# Altium project ENGR451_Project.PrjPcb
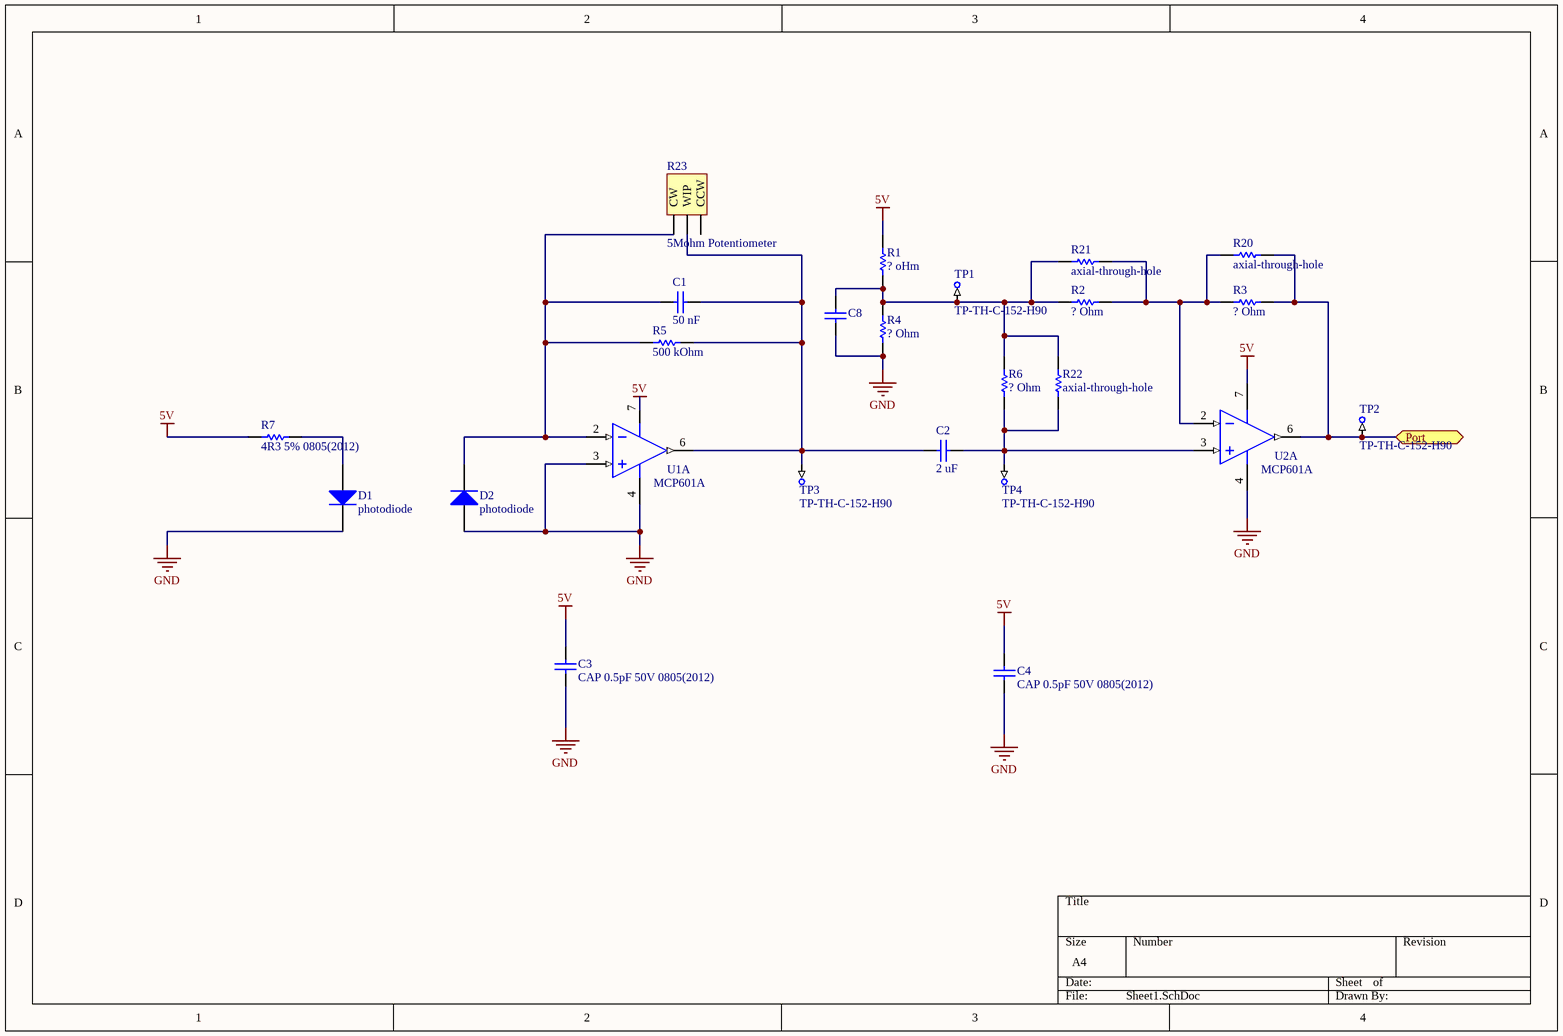
[diagram p0: Sheet1.SchDoc]
2 sheets, 51 parts. Net scope: flat (ports and power ports of the same name join across sheets).
Board file: PCB1.PcbDoc
Sheets:
  Sheet1.SchDoc
  Sheet2.SchDoc

## Sheet Sheet1.SchDoc
size A4

### Parts
C1  50 nF  [CAPC0805(2012)75_M]
C2  2 uF  [CAPC0805(2012)75_M]
C3  CAP 0.5pF 50V 0805(2012)  [CAPC0805(2012)75_M]
C4  CAP 0.5pF 50V 0805(2012)  [CAPC0805(2012)75_M]
C8  CAP 0.5pF 50V 0805(2012)  [CAPC0805(2012)75_M]  (value not drawn)
D1  photodiode  [3mm_diode]
D2  photodiode  [3mm_diode]
R1  ? oHm  [RESC0805(2012)_M]
R2  ? Ohm  [RESC0805(2012)_M]
R3  ? Ohm  [RESC0805(2012)_M]
R4  ? Ohm  [RESC0805(2012)_M]
R5  500 kOhm  [RESC0805(2012)_M]
R6  ? Ohm  [RESC0805(2012)_M]
R7  4R3 5% 0805(2012)  [RESC0805(2012)_M]
R20  axial-through-hole  [Axial_resistor]
R21  axial-through-hole  [Axial_resistor]
R22  axial-through-hole  [Axial_resistor]
R23  5Mohm Potentiometer  [5k_pot]
TP1  TP-TH-C-152-H90  [TP-TH-C-152-H90]  (no BOM)
TP2  TP-TH-C-152-H90  [TP-TH-C-152-H90]  (no BOM)
TP3  TP-TH-C-152-H90  [TP-TH-C-152-H90]  (no BOM)
TP4  TP-TH-C-152-H90  [TP-TH-C-152-H90]  (no BOM)
U1  MCP601A  [ADI-Q-8]  (part A of 2)
U2  MCP601A  [ADI-Q-8]  (part A of 2)

### Ports
Port

### Nets
5V: C3.2 C4.2 R1.2 R7.2 U1.7(+V) U2.7(+V)
GND: C3.1 C4.1 C8.1 D1.2(K) D2.1(A) R4.1 U1.3(+IN) U1.4(-V) U2.4(-V)
NetC1_1: C1.1 C2.2 R5.2 R23.2(WIP) TP3.1 U1.6(OUT)
NetC1_2: C1.2 D2.2(K) R5.1 R23.1(CW) U1.2(-IN)
NetC2_1: C2.1 R6.1 R22.1 TP4.1 U2.3(+IN)
NetC8_2: C8.2 R1.1 R2.1 R4.2 R6.2 R21.1 R22.2 TP1.1
NetD1_1: D1.1(A) R7.1
NetR2_2: R2.2 R3.1 R20.1 R21.2 U2.2(-IN)
NetR3_2: R3.2 R20.2 TP2.1 U2.6(OUT) ; port Port

Not connected (* = marked no-connect by the designer): R23 3(CCW)

### Library data of the parts
C1-C4 C8 = CMP-1036-00018-1: CAP 0.5pF 50V ±0.1pF 0805 (2012 Metric) Thickness 0.75mm SMD; Case-EIA: 0805; Case-Metric: 2012; Tolerance: Â±0.1pF; Value: 0.5pF; Technology: SMT; Rated Voltage: 50 V; Max Thickness: 0.75 mm
R1-R7 = CMP-1013-00017-1: 4R3 0.125W 5% 0805 (2012 Metric)  SMD; Value: 4.30 Ohm; Case-Metric: 2012; Case-EIA: 0805; Tolerance: 5 %; Power: 0.125 W; Technology: SMT
R20-R22 = axial-through-hole: through-hole
R23 = 5Mohm Potentiometer: 3296W-1-505LF; Manufacturer PN: 3296W-1-505LF
TP1-TP4 = CMP-0484-00003-2: Test Point, Through Hole, Hole Size 0.9 mm, PCB Mount with Silkscreen Box; Manufacturer: No Vendor; PartNumber: TP-TH-C-152-H90
U1 U2 = CMP-0384-00317-1: Single Channel Low Power Operational Amplifier, 880 MHz BW, 1 KV/us SR, Military, 8-pin DIP (Q-8), Tube; Manufacturer: Analog Devices; PartNumber: 5962-9459301MPA; Generic Part Number: AD8001; Input Offset Voltage: 2mV; Small Signal Bandwidth: 880MHz; Slew Rate: 1KV/us; Input Bias Current: 3uA; Iq/Amp: 5mA; Amplifiers Per Package: 1; V Span Max: 12V; V Span Min: 6V; DatasheetVersion: Rev. D; PackageReference: Q-8; PackageDescription: 8-Pin Ceramic Dual In-Line Package, Row spacing 7.62 mm, Pitch 2.54 mm; Mounting Technology: Through Hole; ComponentLink1URL: http://www.analog.com/en/index.html; ComponentLink2Description: Datasheet; ComponentLink3URL: http://www.analog.com/static/imported-files/packages/3925655241313314758Q_8.pdf; ComponentLink1Description: Manufacturer URL; ComponentLink2URL: http://www.analog.com/static/imported-files/data_sheets/AD8001.pdf; ComponentLink3Description: Package Specification; PartId: 1
D1 D2 = photodiode: partnumber: *

## Sheet Sheet2.SchDoc
size A4
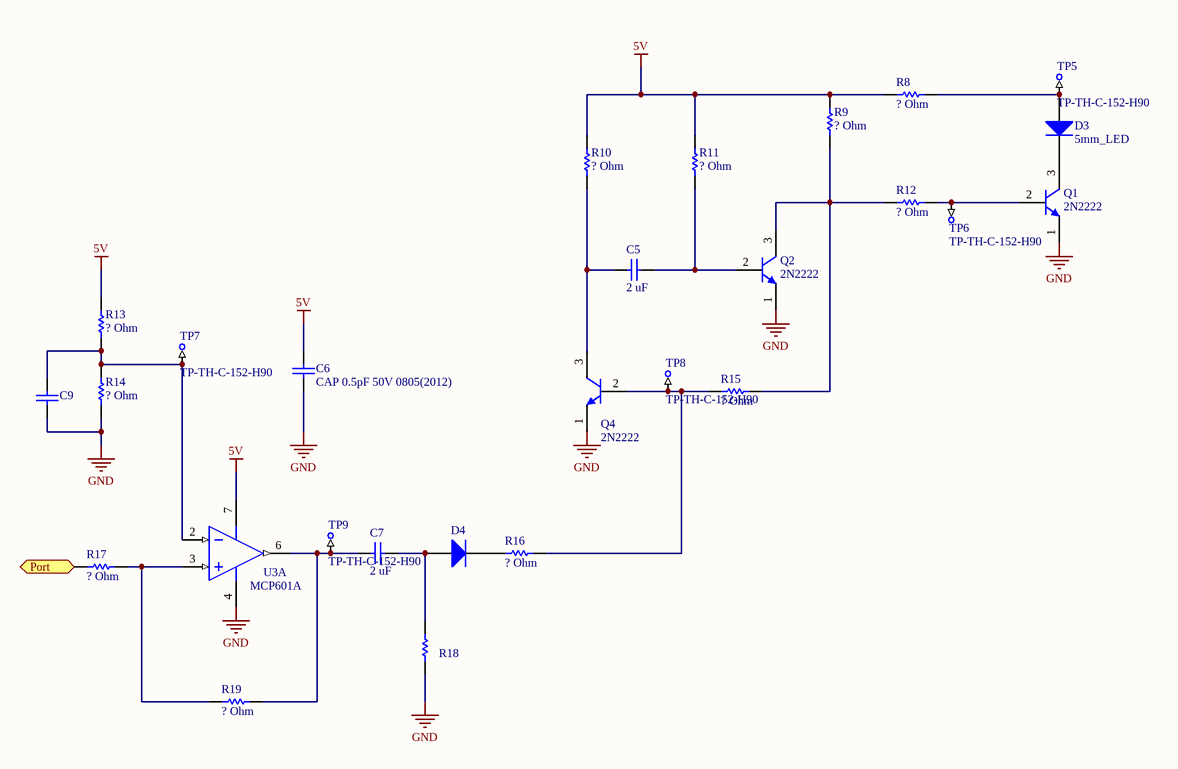
[diagram p1: Sheet2.SchDoc]

### Parts
C5  2 uF  [CAPC0805(2012)75_M]
C6  CAP 0.5pF 50V 0805(2012)  [CAPC0805(2012)75_M]
C7  2 uF  [CAPC0805(2012)75_M]
C9  CAP 0.5pF 50V 0805(2012)  [CAPC0805(2012)75_M]  (value not drawn)
D3  5mm_LED  [3mm_diode]
D4  (no value)  [DIOD-S1M-13-F-SMA-2_V]
Q1  2N2222  [MLTC-TO-18-3]
Q2  2N2222  [MLTC-TO-18-3]
Q4  2N2222  [MLTC-TO-18-3]
R8  ? Ohm  [RESC0805(2012)_M]
R9  ? Ohm  [RESC0805(2012)_M]
R10  ? Ohm  [RESC0805(2012)_M]
R11  ? Ohm  [RESC0805(2012)_M]
R12  ? Ohm  [RESC0805(2012)_M]
R13  ? Ohm  [RESC0805(2012)_M]
R14  ? Ohm  [RESC0805(2012)_M]
R15  ? Ohm  [RESC0805(2012)_M]
R16  ? Ohm  [RESC0805(2012)_M]
R17  ? Ohm  [RESC0805(2012)_M]
R18  (no value)  [RESC0805(2012)_M]
R19  ? Ohm  [RESC0805(2012)_M]
TP5  TP-TH-C-152-H90  [TP-TH-C-152-H90]  (no BOM)
TP6  TP-TH-C-152-H90  [TP-TH-C-152-H90]  (no BOM)
TP7  TP-TH-C-152-H90  [TP-TH-C-152-H90]  (no BOM)
TP8  TP-TH-C-152-H90  [TP-TH-C-152-H90]  (no BOM)
TP9  TP-TH-C-152-H90  [TP-TH-C-152-H90]  (no BOM)
U3  MCP601A  [ADI-Q-8]  (part A of 2)

### Ports
Port

### Nets
5V: C6.2 R8.1 R9.1 R10.1 R11.1 R13.2 U3.7(+V)
GND: C6.1 C9.1 Q1.1(E) Q2.1(E) Q4.1(E) R14.2 R18.2 U3.4(-V)
NetC5_1: C5.1 Q2.2(B) R11.2
NetC5_2: C5.2 Q4.3(C) R10.2
NetC7_1: C7.1 R19.1 TP9.1 U3.6(OUT)
NetC7_2: C7.2 D4.1(A) R18.1
NetC9_2: C9.2 R13.1 R14.1 TP7.1 U3.2(-IN)
NetD3_1: D3.1(A) R8.2 TP5.1
NetD3_2: D3.2(K) Q1.3(C)
NetD4_2: D4.2(K) R16.1
NetQ1_2: Q1.2(B) R12.2 TP6.1
NetQ2_3: Q2.3(C) R9.2 R12.1 R15.2
NetQ4_2: Q4.2(B) R15.1 R16.2 TP8.1
NetR3_2: R17.2 ; port Port
NetR17_1: R17.1 R19.2 U3.3(+IN)

### Library data of the parts
C5-C7 C9 = CMP-1036-00018-1: as C1 on sheet Sheet1; Value: 0.5pF; Technology: SMT; Rated Voltage: 50 V; Max Thickness: 0.75 mm
D3 = 5mm_LED: Manufacturer PN: TLHG6405
D4 = CMP-0639-00001-1: Surface Mount Glass Passivated Rectifier, 1000V, 1 A, -65 to 125 degC, 2-Pin SMA Package, RoHS, Tape and Reel; Manufacturer: Diodes Inc; PartNumber: S1M-13-F; Maximum Reverse Current IR (uA): 5; Maximum Peak Forward Surge Current IFSM (A): 30; Maximum Average Rectified Current IO (A): 1; Peak Repetitive Reverse Voltage VRRM (V): 1000; Total Capacitance CT (pF): 10; Forward Voltage Drop VF (V): 1.1; ComponentLink1URL: http://www.diodes.com/; Operating Temperature Range: -65 to 150 degC; ComponentLink3URL: http://diodes.com/datasheets/ds16003.pdf; ComponentLink3Description: Package Specification; PackageDescription: 2-Pin SMD, Body 4.3 x 2.605 mm, Height 2.3 mm; Mounting Technology: Surface Mount; ComponentLink1Description: Manufacturer URL; PackageReference: S1M-13-F-SMA-2; ComponentLink2URL: http://diodes.com/datasheets/ds16003.pdf; ComponentLink2Description: Datasheet; RoHS: TRUE; DatasheetVersion: Rev. 22 - 2; Packing: Tape and Reel; PackageVersion: Rev. 22 - 2
Q1 Q2 Q4 = CMP-2000-05237-1: Low Power Bipolar NPN Transistor, 30 V, -65 to 200 degC, 3-Pin TO-18, RoHS, Bulk; Manufacturer: Multicomp; Pin Configuration: a; No. of Pins: 3; No. of Transistors: 1; Collector Emitter Voltage Vces: 400mV; Current Ic Continuous a Max: 800mA; Power Dissipation Pd: 500mW; Collector Emitter Voltage V(br)ceo: 30V; Gain Bandwidth ft Typ: 250MHz; Voltage Vcbo: 60V; DC Current Gain hFE: 100; Full Power Rating Temperature: 25degC; Current Ic @ Vce Sat: 150mA; SVHC: NoSVHC(19-Dec-2012); Package Reference: TO-18-3; Package Description: 3-Pin Transistor Outline Package (TO-18), Dia 5.54 mm, Pitch Pitch 1.485mm; Datasheet URL: http://www.farnell.com/datasheets/1662272.pdf; Transistor Case Style: TO-18; Continuous Collector Current Ic Max: 800mA; Manufacturer URL: http://uk.farnell.com/b/multicomp; DC Collector Current: 800mA; Hfe Min: 100; Transistor Polarity: NPN; Power Dissipation Ptot Max: 500mW; Package / Case: TO-18; Datasheet Version: Rev. 1.1, 05/2012; Gain Bandwidth ft Min: 250MHz; Current Ic hFE: 150mA
R8-R19 = CMP-1013-00017-1: as R1 on sheet Sheet1; Tolerance: 5 %; Power: 0.125 W; Technology: SMT
TP5-TP9 = CMP-0484-00003-2: as TP1 on sheet Sheet1; PartNumber: TP-TH-C-152-H90
U3 = CMP-0384-00317-1: as U1 on sheet Sheet1; DatasheetVersion: Rev. D; PackageReference: Q-8; PackageDescription: 8-Pin Ceramic Dual In-Line Package, Row spacing 7.62 mm, Pitch 2.54 mm; Mounting Technology: Through Hole; ComponentLink1URL: http://www.analog.com/en/index.html; ComponentLink2Description: Datasheet; ComponentLink3URL: http://www.analog.com/static/imported-files/packages/3925655241313314758Q_8.pdf; ComponentLink1Description: Manufacturer URL; ComponentLink2URL: http://www.analog.com/static/imported-files/data_sheets/AD8001.pdf; ComponentLink3Description: Package Specification; PartId: 1

## Nets that join several sheets
5V: Sheet1 (6 pins), Sheet2 (7 pins)
GND: Sheet1 (9 pins), Sheet2 (8 pins)
NetR3_2: Sheet1 (R3.2 R20.2 TP2.1 U2.6), Sheet2 (R17.2)